# Altium schematic sheet 扩展存储器电路symbol.SchDoc
size A4
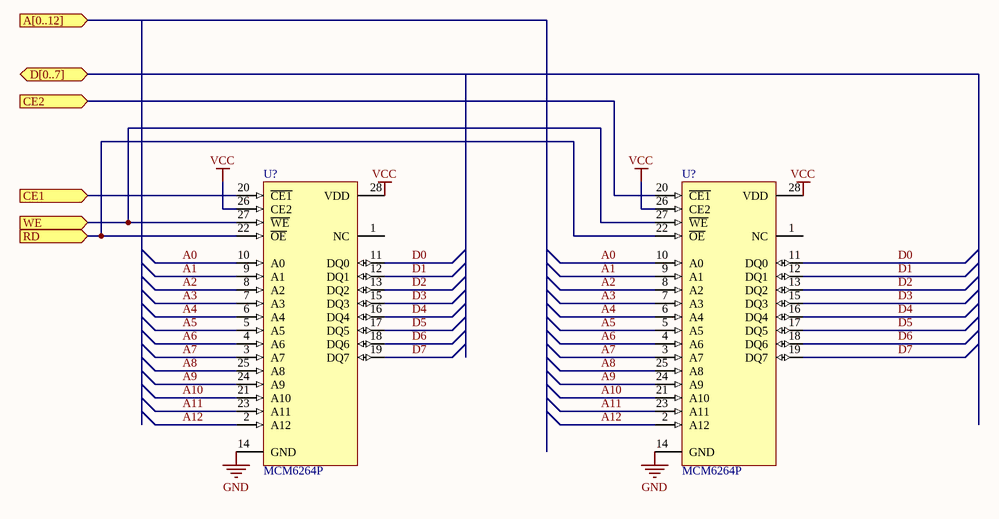
[diagram p0: 扩展存储器电路symbol.SchDoc]

## Parts
(Parts that share a designator on the sheet are numbered #1, #2 ... from top to bottom, then left to right.)
U?#1  MCM6264P  [710B-01]
U?#2  MCM6264P  [710B-01]

## Ports
A[0..12] (in), CE1 (in), CE2 (in), D[0..7] (bidir), RD (in), WE (in)

## Nets
GND: U?#1.14(GND) U?#2.14(GND)
VCC: U?#1.26(CE2) U?#1.28(VDD) U?#2.26(CE2) U?#2.28(VDD)
A0: U?#1.10(A0) U?#2.10(A0)
A1: U?#1.9(A1) U?#2.9(A1)
A2: U?#1.8(A2) U?#2.8(A2)
A3: U?#1.7(A3) U?#2.7(A3)
A4: U?#1.6(A4) U?#2.6(A4)
A5: U?#1.5(A5) U?#2.5(A5)
A6: U?#1.4(A6) U?#2.4(A6)
A7: U?#1.3(A7) U?#2.3(A7)
A8: U?#1.25(A8) U?#2.25(A8)
A9: U?#1.24(A9) U?#2.24(A9)
A10: U?#1.21(A10) U?#2.21(A10)
A11: U?#1.23(A11) U?#2.23(A11)
A12: U?#1.2(A12) U?#2.2(A12)
CE1: U?#1.20(~{CE1}) ; port CE1
CE2: U?#2.20(~{CE1}) ; port CE2
D0: U?#1.11(DQ0) U?#2.11(DQ0)
D1: U?#1.12(DQ1) U?#2.12(DQ1)
D2: U?#1.13(DQ2) U?#2.13(DQ2)
D3: U?#1.15(DQ3) U?#2.15(DQ3)
D4: U?#1.16(DQ4) U?#2.16(DQ4)
D5: U?#1.17(DQ5) U?#2.17(DQ5)
D6: U?#1.18(DQ6) U?#2.18(DQ6)
D7: U?#1.19(DQ7) U?#2.19(DQ7)
RD: U?#1.22(~{OE}) U?#2.22(~{OE}) ; port RD
WE: U?#1.27(~{WE}) U?#2.27(~{WE}) ; port WE

Not connected (* = marked no-connect by the designer): U?#1 1(NC); U?#2 1(NC)

## Library data of the parts
U?#1 U?#2 = MCM6264P: 8K x 8-Bit Fast Static RAM; Published: 17-Jul-2002; LatestRevisionDate: 06-Jun-2005; LatestRevisionNote: Stylized 3D Model Added.; DatasheetVersion: 1991; PackageReference: 710B-01; Publisher: Altium Limited; PackageDescription: DIP; 28 Leads; Row Spacing 7.62 mm; Pitch 2.54 mm; ComponentLink1Description: Manufacturer Link; ComponentLink1URL: http://www.motorola.com/